# EasyEDA schematic robot_sumo_easyeda.json
TITLE: ROBOT SUMO; REV: 0.777; Date: 2024-08-28; Sheet: 1/1; Drawn By: Brayan
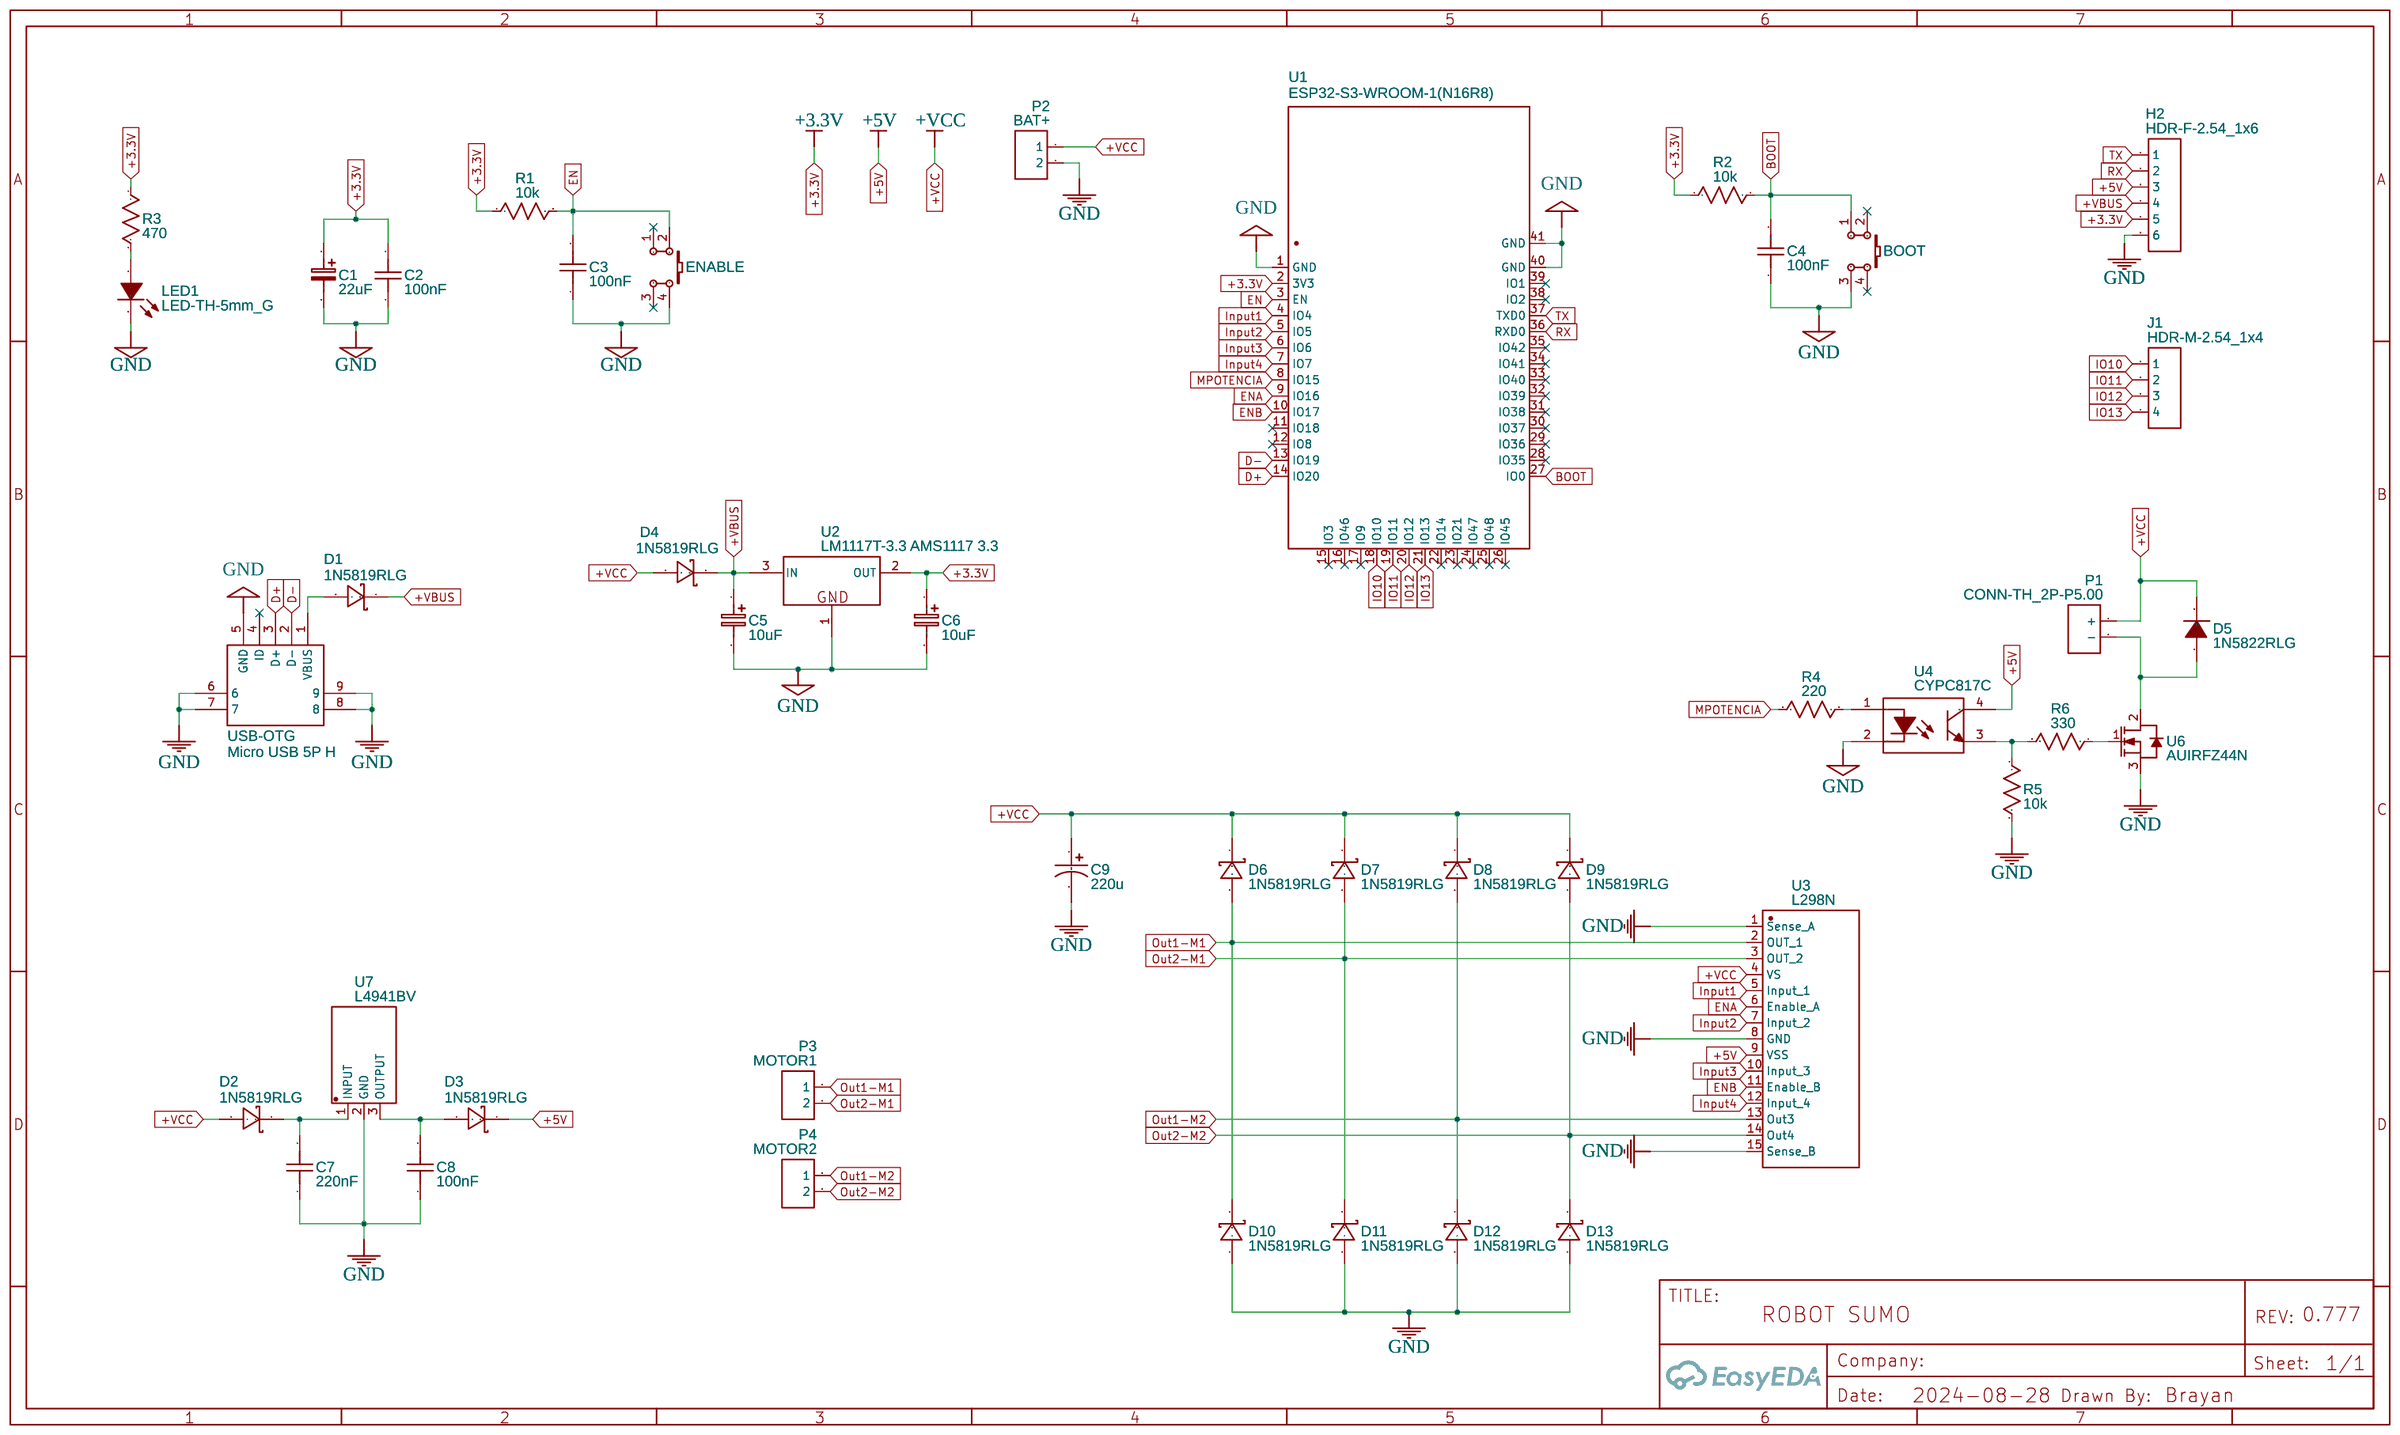
[diagram p0: schematic sheet]

## Parts
BOOT  K4-6×6_TH  [KEY-TH_4P-L6.0-W6.0-P4.50-LS6.5]
C1  22uF  [CAP-D5.0×F2.0]
C2  100nF  [CAP-TH_L5.3-W2.2-P2.54_CC1E104ZA1FD3F5O10MF]
C3  100nF  [CAP-TH_L5.3-W2.2-P2.54_CC1E104ZA1FD3F5O10MF]
C4  100nF  [CAP-TH_L5.3-W2.2-P2.54_CC1E104ZA1FD3F5O10MF]
C5  10uF  [CAP-D5.0×F2.0]
C6  10uF  [CAP-D5.0×F2.0]
C7  220nF  [CAP-TH_L5.3-W2.2-P2.54_CC1E104ZA1FD3F5O10MF]
C8  100nF  [CAP-TH_L5.3-W2.2-P2.54_CC1E104ZA1FD3F5O10MF]
C9  220u  [CAP-D8.0×F3.5]
D1  1N5819RLG  [DO-41_BD2.4-L4.7-P8.70-D0.9-RD]
D2  1N5819RLG  [DO-41_BD2.4-L4.7-P8.70-D0.9-RD]
D3  1N5819RLG  [DO-41_BD2.4-L4.7-P8.70-D0.9-RD]
D4  1N5819RLG  [DO-41_BD2.4-L4.7-P8.70-D0.9-RD]
D5  1N5822RLG  [DO-201AD_BD5.3-L8.4-P12.50-D1.4-RD]
D6  1N5819RLG  [DO-41_BD2.4-L4.7-P8.70-D0.9-RD]
D7  1N5819RLG  [DO-41_BD2.4-L4.7-P8.70-D0.9-RD]
D8  1N5819RLG  [DO-41_BD2.4-L4.7-P8.70-D0.9-RD]
D9  1N5819RLG  [DO-41_BD2.4-L4.7-P8.70-D0.9-RD]
D10  1N5819RLG  [DO-41_BD2.4-L4.7-P8.70-D0.9-RD]
D11  1N5819RLG  [DO-41_BD2.4-L4.7-P8.70-D0.9-RD]
D12  1N5819RLG  [DO-41_BD2.4-L4.7-P8.70-D0.9-RD]
D13  1N5819RLG  [DO-41_BD2.4-L4.7-P8.70-D0.9-RD]
ENABLE  K4-6×6_TH  [KEY-TH_4P-L6.0-W6.0-P4.50-LS6.5]
H2  HDR-F-2.54_1x6  [HDR-F-2.54_1X6]
J1  HDR-M-2.54_1x4  [HDR-M-2.54_1X4]
LED1  LED-TH-5mm_G  [LED-TH_BD5.0_GREEN]
P1  CONN-TH_2P-P5.00  [CONN-TH_2P-P5.00]
P2  BAT+  [CONN-TH_2P-P5.00]
P3  MOTOR1  [CONN-TH_2P-P5.00]
P4  MOTOR2  [CONN-TH_2P-P5.00]
R1  10k  [R_AXIAL-0.4]
R2  10k  [R_AXIAL-0.4]
R3  470  [R_AXIAL-0.4]
R4  220  [R_AXIAL-0.4]
R5  10k  [R_AXIAL-0.4]
R6  330  [R_AXIAL-0.4]
U1  ESP32-S3-WROOM-1(N16R8)  [WIRELM-SMD_ESP32-S3-WROOM-1]
U2  LM1117T-3.3 AMS1117 3.3  [TO-220-3_L10.0-W4.5-P2.54-L]
U3  L298N  [MULTIWATT-15_L19.6-W5.0-P1.27-L]
U4  CYPC817C  [DIP-4_L6.4-W4.6-P2.54-LS7.6-BL]
U6  AUIRFZ44N  [TO-220-3_L10.5-W4.8-P2.54-L]
U7  L4941BV  [TO-220AB-3_L10.4-W4.6-P2.54-T]
USB-OTG  Micro USB 5P H  [MICRO-USB_MICRO-USB-30]

## Library data of the parts
BOOT ENABLE = K4-6×6_TH: Supplier: LCSC; Supplier Part: C136684; Manufacturer: 韩国韩荣; Manufacturer Part: K2-1102DP-E4SW-04; Contributor: LCEDA_Lib
C1 C5 C6 = CE_TH_D5.0×F2.0_EU: Contributor: LCEDA_Lib
C2-C4 C7 C8 = CC1E104ZA1FD3F5O10MF: Supplier: LCSC; Supplier Part: C254077; Manufacturer: Dersonic(德尔创); JLCPCB Part Class: Extended Part; Contributor: lcsc
C9 = CE_TH_D8.0×F3.5_US: Contributor: LCEDA_Lib
D1-D4 D6-D13 = 1N5819RLG: Contributor: LCSC; Supplier: LCSC; Supplier Part: C88393; Manufacturer: onsemi(安森美); JLCPCB Part Class: Extended Part
D5 = 1N5822RLG: Contributor: LCSC; Supplier: LCSC; Supplier Part: C232464; Manufacturer: onsemi(安森美); JLCPCB Part Class: Extended Part
H2 = HDR-F-2.54_1x6: Supplier Part: C40877; Supplier: LCSC; Contributor: LCEDA_Lib
J1 = HDR-M-2.54_1x4: Supplier Part: C124378; Supplier: LCSC; Contributor: LCEDA_Lib
LED1 = LED-TH-5mm_G: Manufacturer: EVERLIGHT(台湾亿光); Manufacturer Part: 333-2SYGD/S530-E2; Supplier Part: C88163; Supplier: LCSC; Contributor: LCEDA_Lib
P1-P4 = CONN-TH_2P-P5.00: Supplier: LCSC; Contributor: LCEDA_Lib
R1-R6 = R_AXIAL-0.4_US: Contributor: LCEDA_Lib
U1 = ESP32-S3-WROOM-1(N16R8): Contributor: lcsc; Supplier: LCSC; Supplier Part: C2913202; Manufacturer: ESPRESSIF(乐鑫); Manufacturer Part: ESP32-S3-WROOM-1-N16R8; JLCPCB Part Class: Extended Part
U2 = LM1117T-3.3: Contributor: LCSC; Supplier: LCSC; Supplier Part: C498321; Manufacturer: HGSEMI(华冠); JLCPCB Part Class: Extended Part
U3 = L298N: Contributor: LCSC; Supplier: LCSC; Supplier Part: C434589; Manufacturer: HGSEMI(华冠); JLCPCB Part Class: Extended Part
U4 = CYPC817C: Contributor: LCSC; Supplier: LCSC; Supplier Part: C385059; Manufacturer: OCIC(卓睿科); JLCPCB Part Class: Extended Part
U6 = AUIRFZ44N: Contributor: lcsc; Supplier: LCSC; Supplier Part: C3280774; Manufacturer: Infineon(英飞凌); JLCPCB Part Class: Extended Part
U7 = L4941BV: Contributor: LCSC; Supplier: LCSC; Supplier Part: C283395; Manufacturer: ST(意法半导体); JLCPCB Part Class: Extended Part
USB-OTG = Micro USB 5P H: Contributor: LCSC; Supplier: LCSC; Supplier Part: C40946; Manufacturer: 精拓金; Manufacturer Part: 920-E52A2021S10101; JLCPCB Part Class: Extended Part

## Nets
+3.3V: C1.1 C2.2 C6.1 H2.5 R1.1 R2.1 R3.1 U1.2(3V3) U2.2(OUT)
+5V: D3.1(C) H2.3 U3.9(VSS) U4.4(COL)
+VBUS: C5.1 D1.1(C) D4.1(C) H2.4 U2.3(IN)
+VCC: C9.1 D2.2(A) D4.2(A) D5.1(C) D6.1(C) D7.1(C) D8.1(C) D9.1(C) P1.1(+) P2.1 U3.4(VS)
GND: BOOT.3 C1.2 C2.1 C3.1 C4.1 C5.2 C6.2 C7.1 C8.1 C9.2 D10.2(A) D11.2(A) D12.2(A) D13.2(A) ENABLE.4 H2.6 LED1.2 P2.2 R5.2 U1.1(GND) U1.40(GND) U1.41(GND) U2.1(GND) U3.1(Sense A) U3.8(GND) U3.15(Sense B) U4.2(CAT) U6.3(S) U7.2(GND) USB-OTG.5(GND) USB-OTG.6 USB-OTG.7 USB-OTG.8 USB-OTG.9
BOOT: BOOT.1 C4.2 R2.2 U1.27(IO0)
D+: U1.14(IO20) USB-OTG.3(D+)
D-: U1.13(IO19) USB-OTG.2(D-)
EN: C3.2 ENABLE.2 R1.2 U1.3(EN)
ENA: U1.9(IO16) U3.6(Enable A)
ENB: U1.10(IO17) U3.11(Enable B)
Input1: U1.4(IO4) U3.5(Input 1)
Input2: U1.5(IO5) U3.7(Input 2)
Input3: U1.6(IO6) U3.10(Input 3)
Input4: U1.7(IO7) U3.12(Input 4)
IO10: J1.1 U1.18(IO10)
IO11: J1.2 U1.19(IO11)
IO12: J1.3 U1.20(IO12)
IO13: J1.4 U1.21(IO13)
MPOTENCIA: R4.2 U1.8(IO15)
Out1-M1: D6.2(A) D10.1(C) P3.1 U3.2(OUT 1)
Out1-M2: D8.2(A) D12.1(C) P4.1 U3.13(Out3)
Out2-M1: D7.2(A) D11.1(C) P3.2 U3.3(OUT 2)
Out2-M2: D9.2(A) D13.1(C) P4.2 U3.14(Out4)
RX: H2.2 U1.36(RXD0)
TX: H2.1 U1.37(TXD0)
Net-(C7-2): C7.2 D2.1(C) U7.1(INPUT)
Net-(C8-2): C8.2 D3.2(A) U7.3(OUTPUT)
Net-(D1-2): D1.2(A) USB-OTG.1(VBUS)
Net-(D5-2): D5.2(A) P1.2(-) U6.2(D)
Net-(LED1-1): LED1.1 R3.2
Net-(R4-1): R4.1 U4.1(AN)
Net-(R5-1): R5.1 R6.2 U4.3(EMI)
Net-(R6-1): R6.1 U6.1(G)

Not connected (* = marked no-connect by the designer): BOOT 2* 4*; ENABLE 1* 3*; U1 11(IO18)* 12(IO8)* 15(IO3)* 16(IO46)* 17(IO9)* 22(IO14)* 23(IO21)* 24(IO47)* 25(IO48)* 26(IO45)* 28(IO35)* 29(IO36)* 30(IO37)* 31(IO38)* 32(IO39)* 33(IO40)* 34(IO41)* 35(IO42)* 38(IO2)* 39(IO1)*; USB-OTG 4(ID)*
